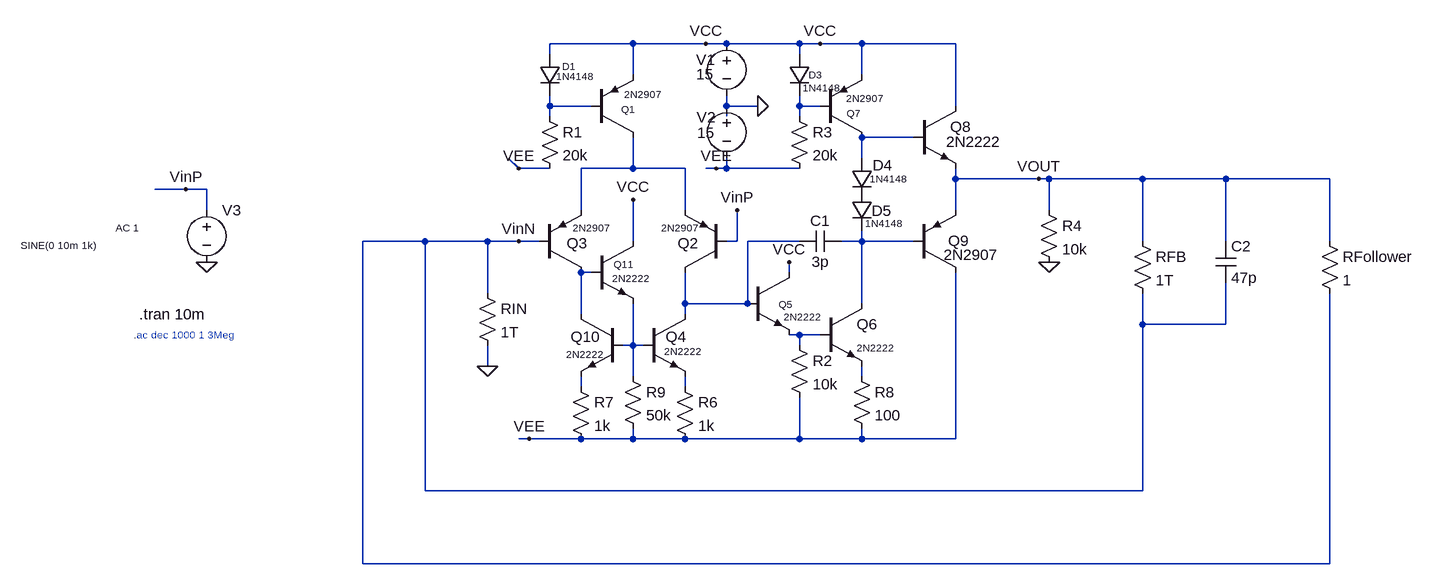
[diagram p0: schematic lm741.asc]
lm741.asc, the LTspice schematic file:
Version 4.1
SHEET 1 1532 900
WIRE 320 96 192 96
WIRE 432 96 320 96
WIRE 464 96 432 96
WIRE 576 96 464 96
WIRE 608 96 576 96
WIRE 672 96 608 96
WIRE 816 96 672 96
WIRE 192 112 192 96
WIRE 576 112 576 96
WIRE 320 144 320 96
WIRE 672 144 672 96
WIRE 192 192 192 176
WIRE 256 192 192 192
WIRE 464 192 464 176
WIRE 512 192 464 192
WIRE 576 192 576 176
WIRE 608 192 576 192
WIRE 816 192 816 96
WIRE 192 208 192 192
WIRE 464 208 464 192
WIRE 576 208 576 192
WIRE 752 240 672 240
WIRE 672 272 672 240
WIRE 144 288 128 272
WIRE 192 288 144 288
WIRE 320 288 320 240
WIRE 320 288 240 288
WIRE 400 288 320 288
WIRE 448 288 432 288
WIRE 464 288 464 272
WIRE 464 288 448 288
WIRE 576 288 464 288
WIRE 816 304 816 288
WIRE 944 304 816 304
WIRE 960 304 944 304
WIRE 1104 304 960 304
WIRE 1232 304 1104 304
WIRE 1392 304 1232 304
WIRE -368 320 -416 320
WIRE -336 320 -368 320
WIRE 672 336 672 320
WIRE -336 352 -336 320
WIRE 240 352 240 288
WIRE 400 352 400 288
WIRE 816 352 816 304
WIRE 960 352 960 304
WIRE 0 400 -96 400
WIRE 96 400 0 400
WIRE 144 400 96 400
WIRE 176 400 144 400
WIRE 320 400 320 336
WIRE 480 400 480 352
WIRE 480 400 464 400
WIRE 576 400 496 400
WIRE 672 400 672 384
WIRE 672 400 640 400
WIRE 752 400 672 400
WIRE 1104 400 1104 304
WIRE 1232 400 1232 304
WIRE 1392 400 1392 304
WIRE 256 448 240 448
WIRE 560 448 560 432
WIRE 96 480 96 400
WIRE 400 496 400 448
WIRE 496 496 496 400
WIRE 496 496 400 496
WIRE 672 496 672 400
WIRE 240 512 240 448
WIRE 400 512 400 496
WIRE 1104 528 1104 480
WIRE 1232 528 1232 464
WIRE 1232 528 1104 528
WIRE 576 544 560 544
WIRE 608 544 576 544
WIRE 320 560 320 496
WIRE 320 560 304 560
WIRE 336 560 320 560
WIRE 576 560 576 544
WIRE 96 592 96 560
WIRE 320 608 320 560
WIRE 672 608 672 592
WIRE 240 624 240 608
WIRE 400 624 400 608
WIRE 160 704 144 704
WIRE 240 704 160 704
WIRE 320 704 320 688
WIRE 320 704 240 704
WIRE 400 704 320 704
WIRE 576 704 576 640
WIRE 576 704 400 704
WIRE 672 704 672 688
WIRE 672 704 576 704
WIRE 816 704 816 448
WIRE 816 704 672 704
WIRE 0 784 0 400
WIRE 1104 784 1104 528
WIRE 1104 784 0 784
WIRE -96 896 -96 400
WIRE 1392 896 1392 480
WIRE 1392 896 -96 896
FLAG 144 288 VEE
FLAG 608 96 VCC
FLAG 160 704 VEE
FLAG 560 432 VCC
FLAG 944 304 VOUT
FLAG 144 400 VinN
FLAG 480 352 VinP
FLAG 512 192 0
FLAG 432 96 VCC
FLAG 448 288 VEE
FLAG 960 432 0
FLAG -336 432 0
FLAG 320 336 VCC
FLAG -368 320 VinP
FLAG 96 592 0
SYMBOL pnp 256 240 M180
WINDOW 0 46 43 Left 1
WINDOW 3 50 66 Left 1
SYMATTR InstName Q1
SYMATTR Value 2N2907
SYMBOL pnp 464 448 R180
WINDOW 0 43 45 Left 2
WINDOW 3 44 69 Left 1
SYMATTR InstName Q2
SYMATTR Value 2N2907
SYMBOL pnp 176 448 M180
WINDOW 0 42 45 Left 2
WINDOW 3 51 69 Left 1
SYMATTR InstName Q3
SYMATTR Value 2N2907
SYMBOL diode 176 112 R0
WINDOW 0 35 19 Left 1
WINDOW 3 26 34 Left 1
SYMATTR InstName D1
SYMATTR Value 1N4148
SYMBOL npn 336 512 R0
WINDOW 0 34 35 Left 2
WINDOW 3 32 57 Left 1
SYMATTR InstName Q4
SYMATTR Value 2N2222
SYMBOL res 176 192 R0
SYMATTR InstName R1
SYMATTR Value 20k
SYMBOL npn 496 448 R0
WINDOW 0 48 49 Left 1
WINDOW 3 56 68 Left 1
SYMATTR InstName Q5
SYMATTR Value 2N2222
SYMBOL npn 608 496 R0
WINDOW 3 56 68 Left 1
SYMATTR Value 2N2222
SYMATTR InstName Q6
SYMBOL res 560 544 R0
SYMATTR InstName R2
SYMATTR Value 10k
SYMBOL cap 640 384 R90
WINDOW 0 0 32 VBottom 2
WINDOW 3 32 32 VTop 2
SYMATTR InstName C1
SYMATTR Value 3p
SYMBOL pnp 608 240 M180
WINDOW 0 41 37 Left 1
WINDOW 3 40 60 Left 1
SYMATTR InstName Q7
SYMATTR Value 2N2907
SYMBOL diode 560 112 R0
WINDOW 0 30 32 Left 1
WINDOW 3 21 52 Left 1
SYMATTR InstName D3
SYMATTR Value 1N4148
SYMBOL res 560 192 R0
SYMATTR InstName R3
SYMATTR Value 20k
SYMBOL diode 656 272 R0
WINDOW 0 33 11 Left 2
WINDOW 3 28 32 Left 1
SYMATTR InstName D4
SYMATTR Value 1N4148
SYMBOL diode 656 320 R0
WINDOW 0 31 33 Left 2
WINDOW 3 21 52 Left 1
SYMATTR InstName D5
SYMATTR Value 1N4148
SYMBOL npn 752 192 R0
WINDOW 3 50 55 Left 2
SYMATTR Value 2N2222
SYMATTR InstName Q8
SYMBOL pnp 752 448 M180
WINDOW 0 53 49 Left 2
WINDOW 3 46 27 Left 2
SYMATTR InstName Q9
SYMATTR Value 2N2907
SYMBOL voltage 464 80 R0
WINDOW 123 0 0 Left 2
WINDOW 39 0 0 Left 2
WINDOW 0 -47 41 Left 2
WINDOW 3 -47 63 Left 2
SYMATTR InstName V1
SYMATTR Value 15
SYMBOL voltage 464 176 R0
WINDOW 123 0 0 Left 2
WINDOW 39 0 0 Left 2
WINDOW 0 -46 33 Left 2
WINDOW 3 -45 57 Left 2
SYMATTR InstName V2
SYMATTR Value 15
SYMBOL res 944 336 R0
SYMATTR InstName R4
SYMATTR Value 10k
SYMBOL voltage -336 336 R0
WINDOW 123 -140 43 Left 1
WINDOW 39 0 0 Left 2
WINDOW 3 -286 70 Left 1
SYMATTR Value2 AC 1
SYMATTR Value SINE(0 10m 1k)
SYMATTR InstName V3
SYMBOL res 384 608 R0
SYMATTR InstName R6
SYMATTR Value 1k
SYMBOL res 656 592 R0
SYMATTR InstName R8
SYMATTR Value 100
SYMBOL npn 304 512 M0
WINDOW 0 34 35 Left 2
WINDOW 3 30 62 Left 1
SYMATTR InstName Q10
SYMATTR Value 2N2222
SYMBOL res 224 608 R0
SYMATTR InstName R7
SYMATTR Value 1k
SYMBOL npn 256 400 R0
WINDOW 0 34 35 Left 1
WINDOW 3 32 57 Left 1
SYMATTR InstName Q11
SYMATTR Value 2N2222
SYMBOL res 304 592 R0
SYMATTR InstName R9
SYMATTR Value 50k
SYMBOL res 1088 384 R0
SYMATTR InstName RFB
SYMATTR Value 1T
SYMBOL res 80 464 R0
SYMATTR InstName RIN
SYMATTR Value 1T
SYMBOL cap 1216 400 R0
SYMATTR InstName C2
SYMATTR Value 47p
SYMBOL res 1376 384 R0
SYMATTR InstName RFollower
SYMATTR Value 1
TEXT -440 512 Left 2 !.tran 10m
TEXT -448 544 Left 1 ;.ac dec 1000 1 3Meg

The netlist it stands for:
* lm741.asc
Q1 N004 N001 VCC 0 2N2907
Q2 N006 VinP N004 0 2N2907
Q3 N008 VinN N004 0 2N2907
D1 VCC N001 1N4148
Q4 N006 N010 N013 0 2N2222
R1 N001 VEE 20k
Q5 VCC N006 N009 0 2N2222
Q6 N007 N009 N011 0 2N2222
R2 N009 VEE 10k
C1 N007 N006 3p
Q7 N003 N002 VCC 0 2N2907
D3 VCC N002 1N4148
R3 N002 VEE 20k
D4 N003 N005 1N4148
D5 N005 N007 1N4148
Q8 VCC N003 VOUT 0 2N2222
Q9 VEE N007 VOUT 0 2N2907
V1 VCC 0 15
V2 0 VEE 15
R4 VOUT 0 10k
V3 VinP 0 SINE(0 10m 1k) AC 1
R6 N013 VEE 1k
R8 N011 VEE 100
Q10 N008 N010 N012 0 2N2222
R7 N012 VEE 1k
Q11 VCC N008 N010 0 2N2222
R9 N010 VEE 50k
RFB VOUT VinN 1T
RIN VinN 0 1T
C2 VOUT VinN 47p
RFollower VOUT VinN 1
.model D D
.lib standard.dio
.model NPN NPN
.model PNP PNP
.lib standard.bjt
.tran 10m
* .ac dec 1000 1 3Meg
.backanno
.end